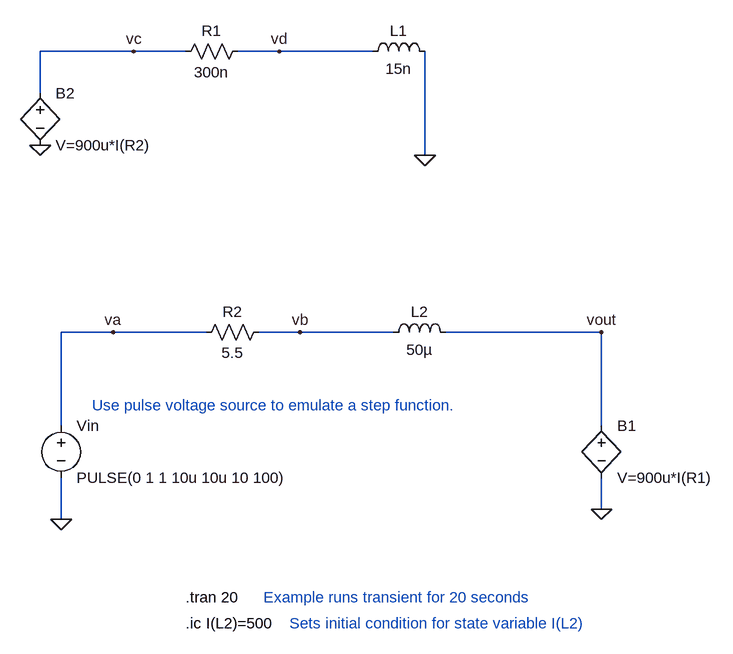
[diagram p0: schematic ol_model.asc]
ol_model.asc, the LTspice schematic file:
Version 4
SHEET 1 1604 776
WIRE 384 -144 240 -144
WIRE 464 -144 384 -144
WIRE 608 -144 544 -144
WIRE 752 -144 608 -144
WIRE 240 -80 240 -144
WIRE 832 16 832 -144
WIRE 352 288 272 288
WIRE 496 288 352 288
WIRE 640 288 576 288
WIRE 784 288 640 288
WIRE 1104 288 864 288
WIRE 272 432 272 288
WIRE 1104 432 1104 288
WIRE 1104 560 1104 512
WIRE 272 576 272 512
FLAG 272 576 0
FLAG 240 0 0
FLAG 832 16 0
FLAG 1104 560 0
FLAG 640 288 vb
FLAG 352 288 va
FLAG 384 -144 vc
FLAG 608 -144 vd
FLAG 1104 288 vout
SYMBOL voltage 272 416 R0
SYMATTR InstName Vin
SYMATTR Value PULSE(0 1 1 10u 10u 10 100)
SYMBOL bv 1104 416 R0
SYMATTR InstName B1
SYMATTR Value V=900u*I(R1)
SYMBOL bv 240 -96 R0
SYMATTR InstName B2
SYMATTR Value V=900u*I(R2)
SYMBOL res 448 -128 R270
WINDOW 0 32 56 VTop 2
WINDOW 3 0 56 VBottom 2
SYMATTR InstName R1
SYMATTR Value 300n
SYMBOL res 480 304 R270
WINDOW 0 32 56 VTop 2
WINDOW 3 0 56 VBottom 2
SYMATTR InstName R2
SYMATTR Value 5.5
SYMBOL ind 736 -128 R270
WINDOW 0 32 56 VTop 2
WINDOW 3 5 56 VBottom 2
SYMATTR InstName L1
SYMATTR Value 15n
SYMATTR SpiceLine Rser=0
SYMBOL ind 768 304 R270
WINDOW 0 32 56 VTop 2
WINDOW 3 5 56 VBottom 2
SYMATTR InstName L2
SYMATTR Value 50µ
SYMATTR SpiceLine Rser=0
TEXT 464 696 Left 2 !.tran 20
TEXT 464 736 Left 2 !.ic I(L2)=500
TEXT 320 400 Left 2 ;Use pulse voltage source to emulate a step function.
TEXT 584 696 Left 2 ;Example runs transient for 20 seconds
TEXT 624 736 Left 2 ;Sets initial condition for state variable I(L2)

The netlist it stands for:
* ol_model.asc
Vin va 0 PULSE(0 1 1 10u 10u 10 100)
B1 vout 0 V=900u*I(R1)
B2 vc 0 V=900u*I(R2)
R1 vc vd 300n
R2 va vb 5.5
L1 vd 0 15n Rser=0
L2 vb vout 50µ Rser=0
.tran 20
.ic I(L2)=500
* Use pulse voltage source to emulate a step function.
* Example runs transient for 20 seconds
* Sets initial condition for state variable I(L2)
.backanno
.end